# Altium schematic sheet MCU.SchDoc: STM32WB55RG microcontroller I/Os
size A4; Author: Ph.A; SheetNumber: 2; SheetTotal: 6
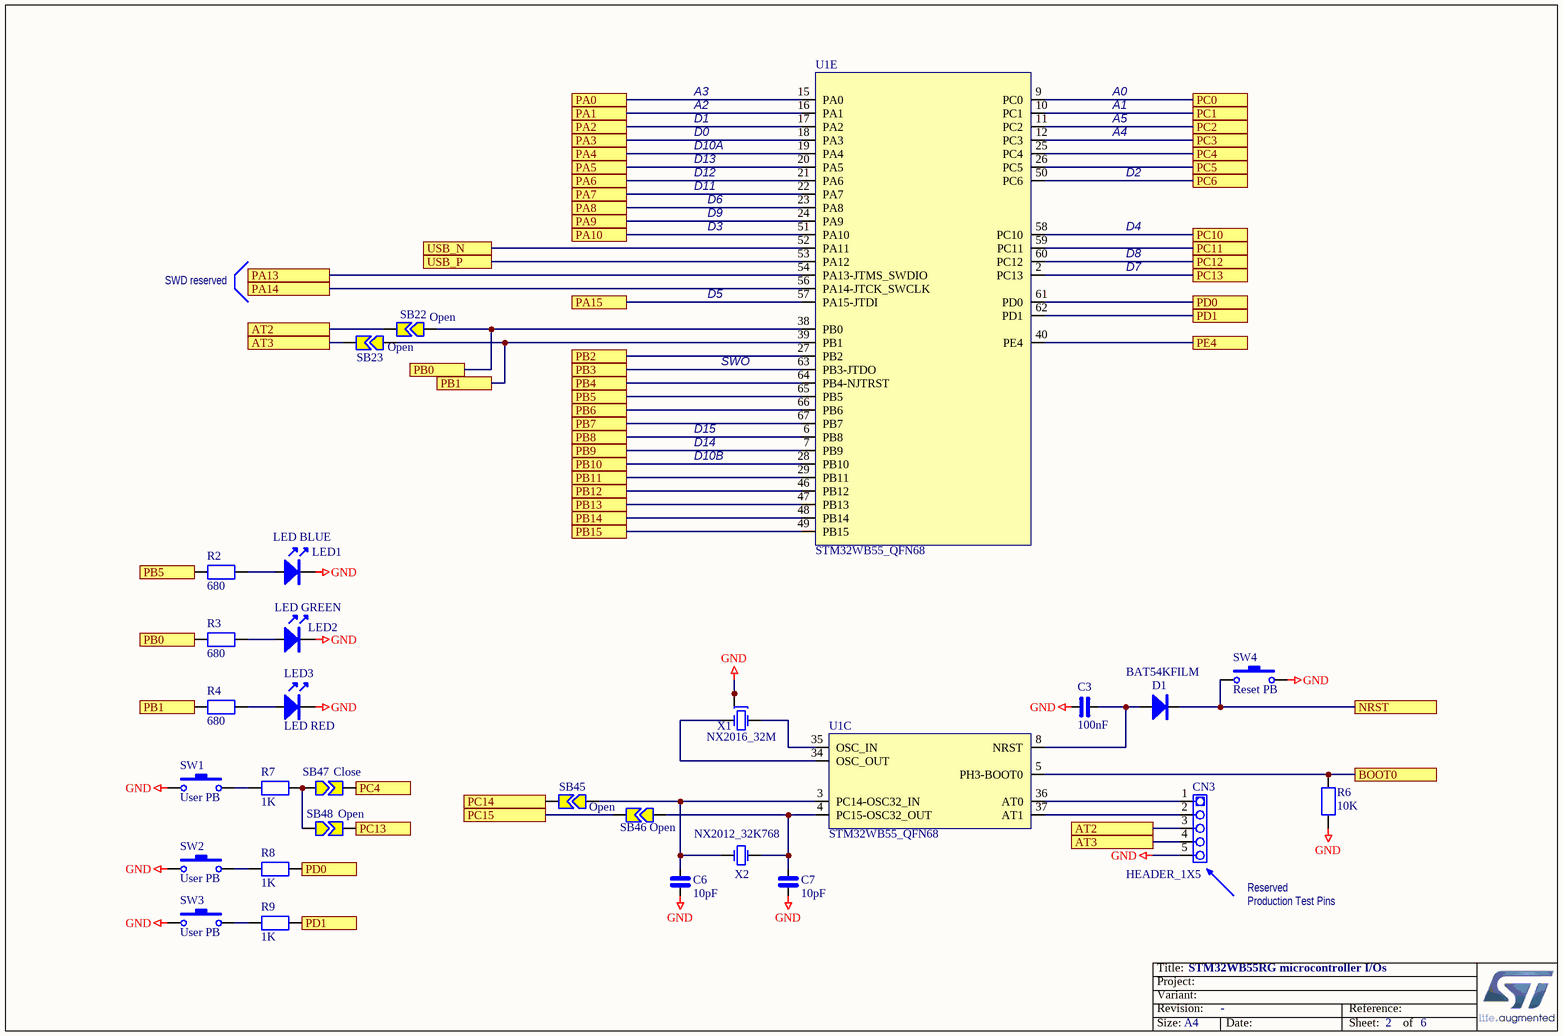
[diagram p0: MCU.SchDoc]

## Parts
C3  100nF  [0402_CAP_NPOL]
C6  10pF  [0402_CAP_NPOL]
C7  10pF  [0402_CAP_NPOL]
CN3  HEADER_1X5  [Header NF 1x5x2.54 TH]
D1  BAT54KFILM  [SOD523]
LED1  LED BLUE  [0603_LED_Blue]
LED2  LED GREEN  [0603_LED_GREEN]
LED3  LED RED  [0603_LED_RED]
R2  680  [0402_RES]
R3  680  [0402_RES]
R4  680  [0402_RES]
R6  10K  [0402_RES]
R7  1K  [0402_RES]
R8  1K  [0402_RES]
R9  1K  [0402_RES]
SB22  Open  [SB-tiny]
SB23  Open  [SB-tiny]
SB45  Open  [SB-tiny]
SB46  Open  [SB-tiny]
SB47  Close  [SB-tiny]
SB48  Open  [SB-tiny]
SW1  User PB  [SW-PB SMD KMR2]
SW2  User PB  [SW-PB SMD KMR2]
SW3  User PB  [SW-PB SMD KMR2]
SW4  Reset PB  [SW-PB SMD KMR2]
U1  STM32WB55_QFN68  [VFQFPN68_8x8x0.1_p0.4]  (parts C,E of 5)
X1  NX2016_32M  [NX2016_4P]
X2  NX2012_32K768  [NX2012_2P]

## Ports
AT2, AT3, BOOT0, NRST, PA0, PA1, PA2, PA3, PA4, PA5, PA6, PA7, PA8, PA9, PA10, PA13, PA14, PA15, PB0, PB1, PB2, PB3, PB4, PB5, PB6, PB7, PB8, PB9, PB10, PB11, PB12, PB13, PB14, PB15, PC0, PC1, PC2, PC3, PC4, PC5, PC6, PC10, PC11, PC12, PC13, PC14, PC15, PD0, PD1, PE4, USB_N, USB_P

## Nets
GND: C3.1 C6.2 C7.2 CN3.5 LED1.K LED2.K LED3.K R6.2 SW1.1 SW2.1 SW3.1 SW4.2 X1.2 X1.4
AT2: CN3.3 SB22.2 ; port AT2
AT3: CN3.4 SB23.2 ; port AT3
BOOT0: R6.1 U1.5(PH3-BOOT0) ; port BOOT0
NRST: D1.K SW4.1 ; port NRST
PA0: U1.15(PA0) ; port PA0
PA1: U1.16(PA1) ; port PA1
PA2: U1.17(PA2) ; port PA2
PA3: U1.18(PA3) ; port PA3
PA4: U1.19(PA4) ; port PA4
PA5: U1.20(PA5) ; port PA5
PA6: U1.21(PA6) ; port PA6
PA7: U1.22(PA7) ; port PA7
PA8: U1.23(PA8) ; port PA8
PA9: U1.24(PA9) ; port PA9
PA10: U1.51(PA10) ; port PA10
PA13: U1.54(PA13-JTMS_SWDIO) ; port PA13
PA14: U1.56(PA14-JTCK_SWCLK) ; port PA14
PA15: U1.57(PA15-JTDI) ; port PA15
PB0: R3.1 SB22.1 U1.38(PB0) ; port PB0
PB1: R4.1 SB23.1 U1.39(PB1) ; port PB1
PB2: U1.27(PB2) ; port PB2
PB3: U1.63(PB3-JTDO) ; port PB3
PB4: U1.64(PB4-NJTRST) ; port PB4
PB5: R2.1 U1.65(PB5) ; port PB5
PB6: U1.66(PB6) ; port PB6
PB7: U1.67(PB7) ; port PB7
PB8: U1.6(PB8) ; port PB8
PB9: U1.7(PB9) ; port PB9
PB10: U1.28(PB10) ; port PB10
PB11: U1.29(PB11) ; port PB11
PB12: U1.46(PB12) ; port PB12
PB13: U1.47(PB13) ; port PB13
PB14: U1.48(PB14) ; port PB14
PB15: U1.49(PB15) ; port PB15
PC0: U1.9(PC0) ; port PC0
PC1: U1.10(PC1) ; port PC1
PC2: U1.11(PC2) ; port PC2
PC3: U1.12(PC3) ; port PC3
PC4: SB47.2 U1.25(PC4) ; port PC4
PC5: U1.26(PC5) ; port PC5
PC6: U1.50(PC6) ; port PC6
PC10: U1.58(PC10) ; port PC10
PC11: U1.59(PC11) ; port PC11
PC12: U1.60(PC12) ; port PC12
PC13: SB48.2 U1.2(PC13) ; port PC13
PC14: SB45.2 ; port PC14
PC15: SB46.2 ; port PC15
PD0: R8.2 U1.61(PD0) ; port PD0
PD1: R9.2 U1.62(PD1) ; port PD1
PE4: U1.40(PE4) ; port PE4
USB_N: U1.52(PA11) ; port USB_N
USB_P: U1.53(PA12) ; port USB_P
NetC3_2: C3.2 D1.A U1.8(NRST)
NetC6_1: C6.1 SB45.1 U1.3(PC14-OSC32_IN) X2.1(OSC1)
NetC7_1: C7.1 SB46.1 U1.4(PC15-OSC32_OUT) X2.2(OSC2)
NetCN3_1: CN3.1 U1.36(AT0)
NetCN3_2: CN3.2 U1.37(AT1)
NetLED1_A: LED1.A R2.2
NetLED2_A: LED2.A R3.2
NetLED3_A: LED3.A R4.2
NetR7_1: R7.1 SW1.2
NetR7_2: R7.2 SB47.1 SB48.1
NetR8_1: R8.1 SW2.2
NetR9_1: R9.1 SW3.2
NetU1_34: U1.34(OSC_OUT) X1.3(OSC2)
NetU1_35: U1.35(OSC_IN) X1.1(OSC1)

## Notes on the sheet
- A2
- A3
- A0
- A1
- D12
- D13
- D0
- D1
- D10A
- A4
- A5
- D2
- D11
- D9
- D3
- D6
- D4
- SWD reserved
- D5
- D7
- D8
- SWO
- D14
- D15
- D10B
- Production Test Pins
- Reserved
- Title:
- Project:
- Size:
- Revision:
- Variant:
- -
- Date:
- Reference:
- Sheet:
- of

## Library data of the parts
C3 C6 C7 = CAP_NPOL: Capacitor_not polarized
D1 = BAT54K: Schottky Diode
LED1-LED3 = LED: Light-Emitting Diode; Part Number A: *
  LED1: Color: BLUE
R2-R4 R6-R9 = RES: Resistor
SB22 SB23 SB45-SB48 = Strap2: Solder Jumper; Solder: YES; Published: 24-Mar-1999; Revision: July-2002: Re-released for DXP Platform.; Publisher: Altium Limited
SW1-SW4 = SW-PB_1: Push-button SMD; Order code RS: 102-412
U1 = STM32WBxx_QFN68
X1 = NX2016_32M: Crystal NDK 2.0x1.6mm  32 MHz; Manufacturer P/N: NX2016SA 32 MHz EXS00A-CS06654; Ref: NX2016SA 32MHz  EXS00A-CS06654  Référence interne NDK : X5087283; Manufacturer: NDK
X2 = NX2012_32K768: Crystal NDK 2.0x1.2mm  32.768 KHz; Manufacturer P/N: NX2012SA 32.768KHz  EXS00A-MU00389; Ref: NX2012SA 32.768KHz  EXS00A-MU00389  Référence interne NDK : X3037088; Manufacturer: NDK